# Altium schematic sheet 08-声音传感器模块-原理图.SchDoc
size A4
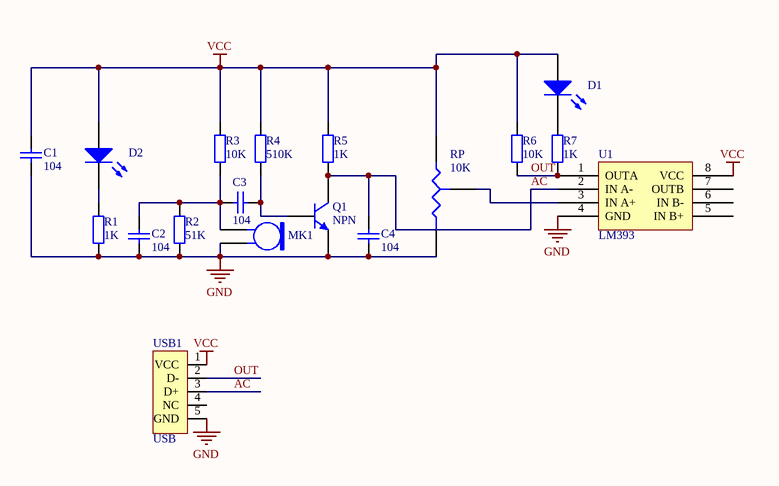
[diagram p0: 08-声音传感器模块-原理图.SchDoc]

## Parts
C1  value 104  [0805]  (hidden comment: Cap)
C2  value 104  [0805]  (hidden comment: Cap)
C3  value 104  [0805]  (hidden comment: Cap)
C4  value 104  [0805]  (hidden comment: Cap)
D1  LED0  [0805]  (value not drawn)
D2  LED0  [0805]  (value not drawn)
MK1  Mic2  [MT]  (value not drawn)
Q1  NPN  [sot-23]
R1  value 1K  [0805]  (hidden comment: res2)
R2  value 51K  [0805]  (hidden comment: res2)
R3  value 10K  [0805]  (hidden comment: res2)
R4  value 510K  [0805]  (hidden comment: res2)
R5  value 1K  [0805]  (hidden comment: res2)
R6  value 10K  [0805]  (hidden comment: res2)
R7  value 1K  [0805]  (hidden comment: res2)
RP  value 10K  [VR]  (hidden comment: Res Tap)
U1  LM393  [SOP-8]
USB1  USB  [USB/SM0.8-6H5]

## Nets
GND: C1.1 C2.1 C4.2 MK1.2 Q1.2(E) R1.1 R2.1 RP.2(B) U1.4(GND) USB1.5(GND)
VCC: C1.2 D1.1(A) D2.1(A) R3.2 R4.2 R5.2 R6.2 RP.1(A) U1.8(VCC) USB1.1(VCC)
AC: C4.1 Q1.3(C) R5.1 U1.2(IN_A-) USB1.3(D+)
OUT: R6.1 R7.1 U1.1(OUTA) USB1.2(D-)
NetC2_2: C2.2 C3.2 MK1.1 R2.2 R3.1
NetC3_1: C3.1 Q1.1(B) R4.1
NetD1_2: D1.2(K) R7.2
NetD2_2: D2.2(K) R1.2
NetRP_3: RP.3(TAP) U1.3(IN_A+)

Not connected (* = marked no-connect by the designer): U1 5(IN_B+) 6(IN_B-) 7(OUTB); USB1 4(NC)

## Library data of the parts
C1-C4 = Cap: Capacitor; Published: 8-Jun-2000; LatestRevisionDate: 17-Jul-2002; LatestRevisionNote: Re-released for DXP Platform.; PackageReference: RAD-0.3; Publisher: Altium Limited
D1 D2 = LED0: Typical INFRARED GaAs LED; Published: 8-Jun-2000; LatestRevisionDate: 08-Jul-2005; LatestRevisionNote: Mech Layer 1 removed.; PackageReference: LED-0; Publisher: Altium Limited
MK1 = Mic2: Microphone; Published: 24-Mar-1999; LatestRevisionDate: 17-Jul-2002; LatestRevisionNote: Re-released for DXP Platform.; PackageReference: PIN2; Publisher: Altium Limited
Q1 = QNPN: NPN Bipolar Transistor; Published: 8-Jun-2000; LatestRevisionDate: 29-May-2009; LatestRevisionNote: IPC-7351 Footprint Added.; PackageVersion: Aug-1999; PackageReference: SOT-23B; Publisher: Altium Limited; PackageDescription: 3-Pin SOT-23 Package 0.95 mm Pitch, 2.4 mm Lead Span
R1-R7 = res2: Resistor; Published: 8-Jun-2000; LatestRevisionDate: 17-Jul-2002; LatestRevisionNote: Re-released for DXP Platform.; PackageReference: AXIAL-0.4; Publisher: Altium Limited
RP = Res Tap: Tapped Resistor; Sim Note: Enter the Resistance value and the set point into parameter fields.; Set Position: 0.5; Published: 24-Mar-1999; LatestRevisionDate: 17-Jul-2002; LatestRevisionNote: Re-released for DXP Platform.; PackageReference: VR3; Publisher: Altium Limited
USB1 = USB5